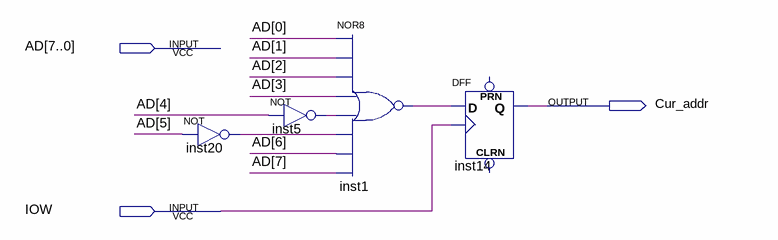
[diagram p0: schematic sheet]
// Quartus schematic selector_ad.bdf as structural Verilog: 4 symbols, 3 pins
module selector_ad (
  input  [7:0] AD,
  input  IOW,
  output Cur_addr
);

  wire inst1_out, inst5_out, inst20_out;

  not inst20 (inst20_out, AD[5]);
  not inst5 (inst5_out, AD[4]);
  nor inst1 (inst1_out, AD[0], AD[1], AD[2], AD[3], inst5_out, inst20_out, AD[6], AD[7]);
  DFF inst14 (.CLK(IOW), .D(inst1_out), .Q(Cur_addr));  // open: CLRN, PRN
endmodule
